# Altium schematic sheet STLink_V2.SchDoc
size A3; DrawnBy: Safak Ozdemir; Revision: V1.0; SheetNumber: 1; SheetTotal: 1
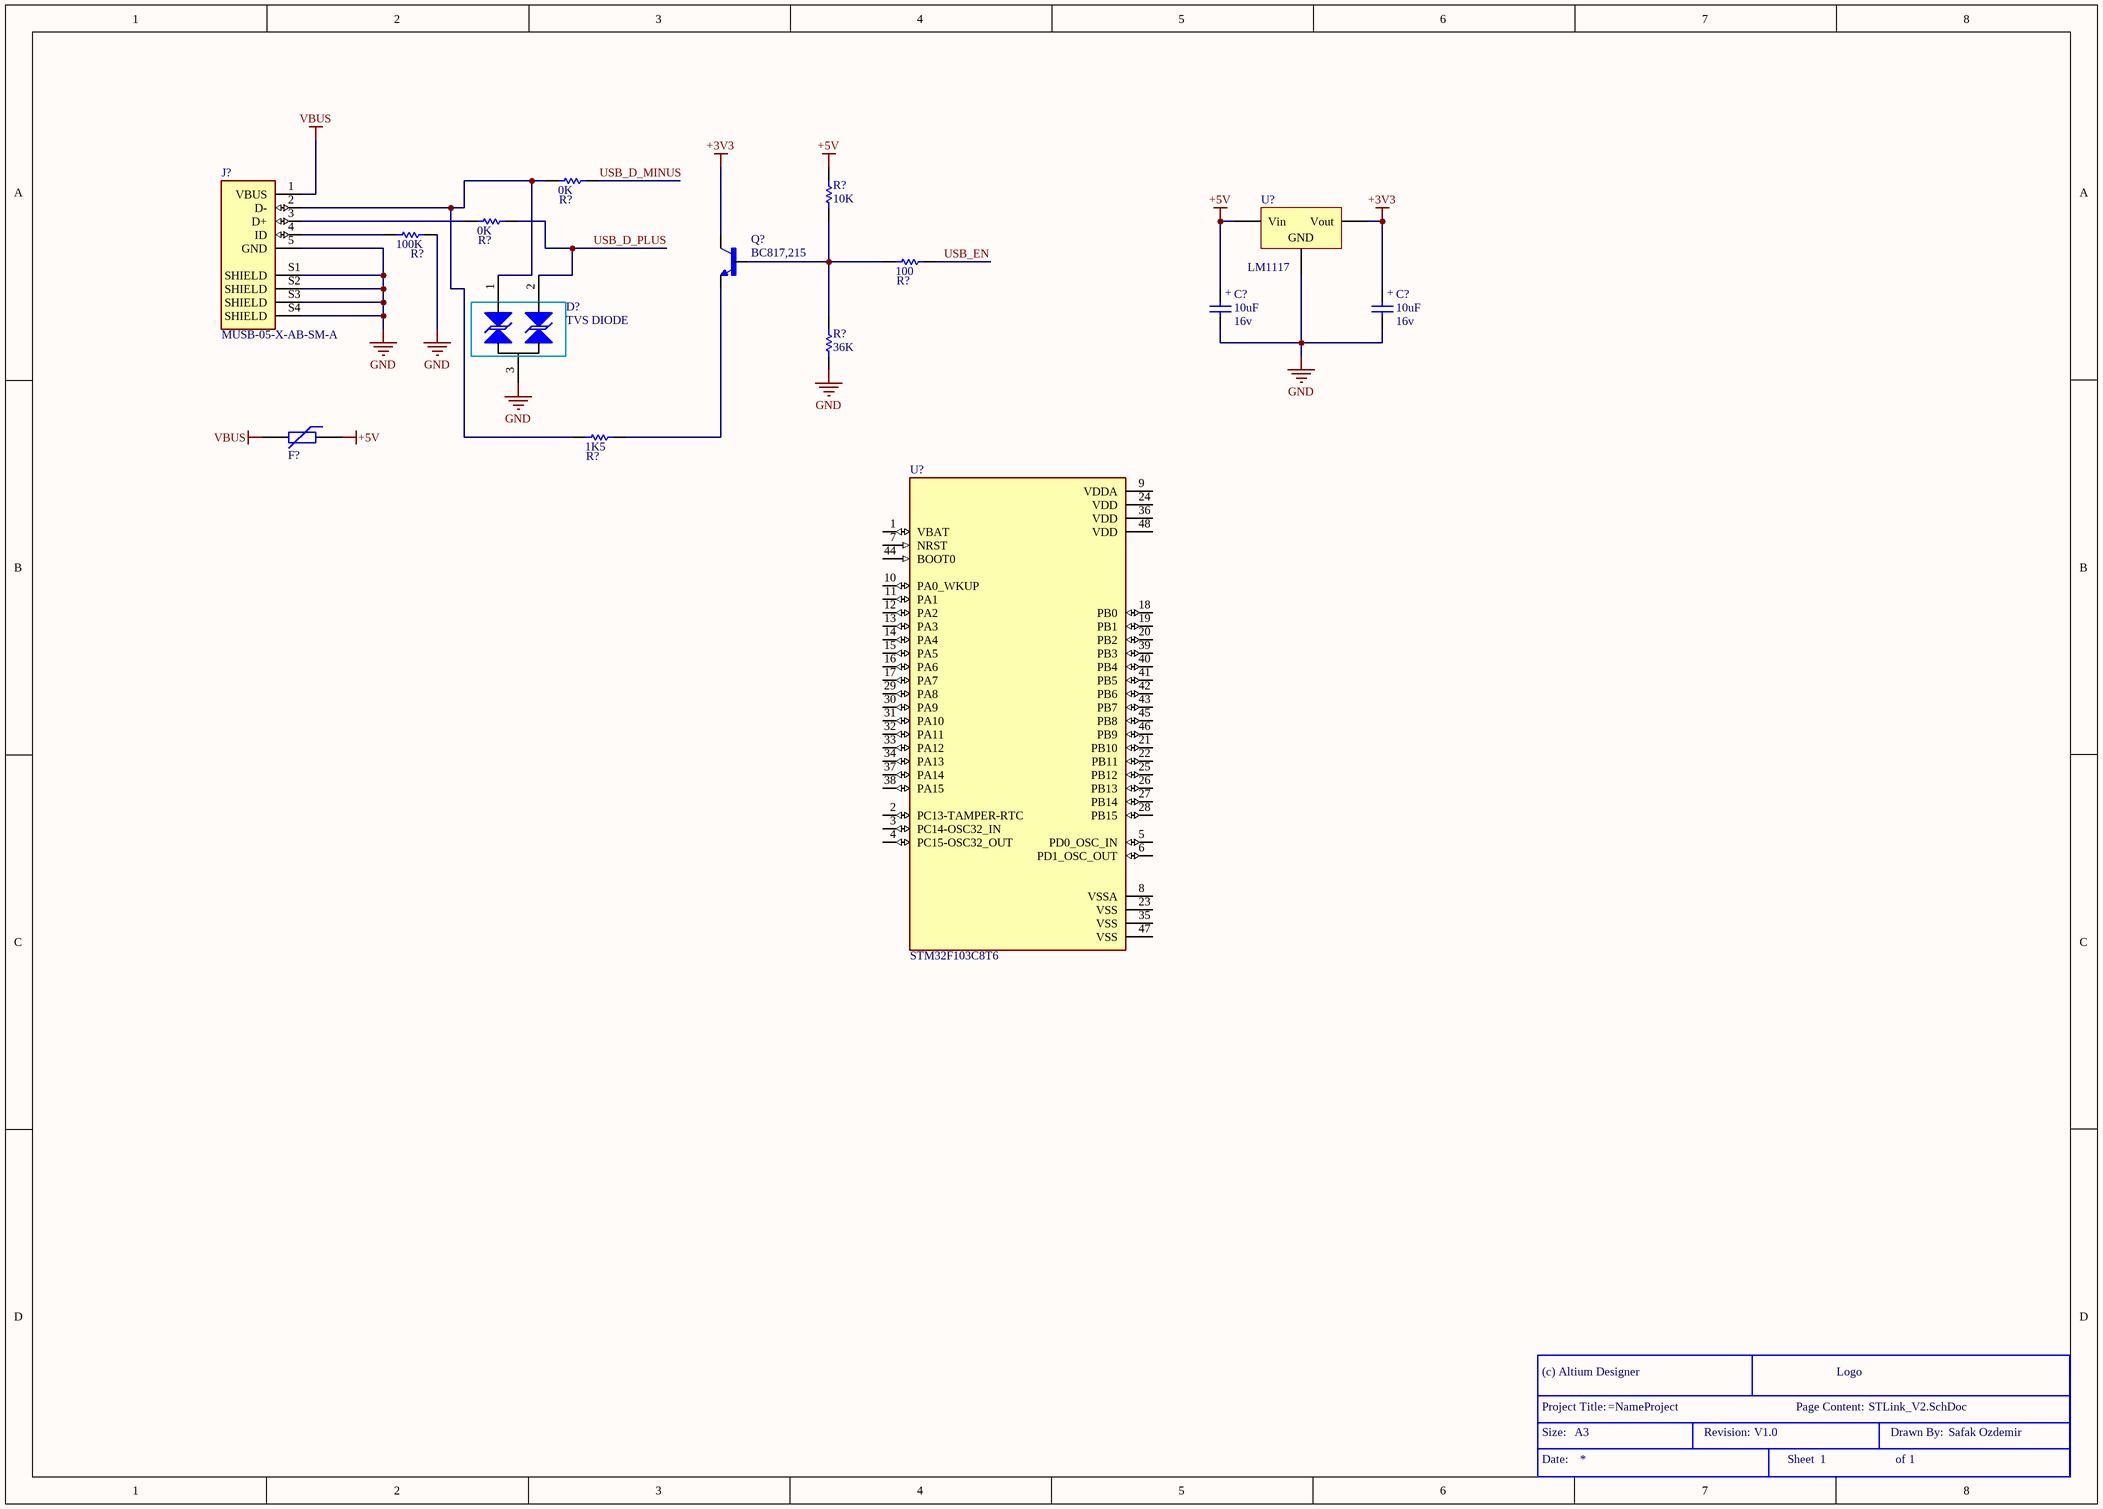
[diagram p0: STLink_V2.SchDoc]

## Parts
(Parts that share a designator on the sheet are numbered #1, #2 ... from top to bottom, then left to right.)
*  Size: A3  Drawn By: Safak Ozdemir  (hidden comment: Title Block)  (graphical)
C?#1  Volte: 16v  [MY_SMC_B]  (hidden comment: 10uF)
C?#2  Volte: 16v  [MY_SMC_B]  (hidden comment: 10uF)
D?  TVS DIODE  [SOT-23]
F?  (no value)  [PTC-0805]
J?  MUSB-05-X-AB-SM-A  [SAMTEC_MUSB-05-X-AB-SM-A]
Q?  BC817,215  [SOT95P230X110-3N]
R?#1  0K  [MY_0805]
R?#2  0K  [MY_0805]
R?#3  10K  [MY_0805]
R?#4  100K  [MY_0805]
R?#5  100  [MY_0805]
R?#6  36K  [MY_0805]
R?#7  1K5  [MY_0805]
U?#1  LM1117  [MY_SOT223]
U?#2  STM32F103C8T6  [QFP50P900X900X160-48N]

## Nets
+3V3: C?#2.+ Q?.3(C) U?#1.2(Vout)
+5V: C?#1.+ F?.1 R?#3.2 U?#1.3(Vin)
GND: C?#1.- C?#2.- D?.3(A) J?.5(GND) J?.S1(SHIELD) J?.S2(SHIELD) J?.S3(SHIELD) J?.S4(SHIELD) R?#4.2 R?#6.2 U?#1.1(GND)
VBUS: F?.2 J?.1(VBUS)
USB_D_MINUS: R?#1.2
USB_D_PLUS: D?.2(K) R?#2.2
USB_EN: R?#5.2
NetD?_1: D?.1(K) J?.2(D-) R?#1.1 R?#7.1
NetJ?_3: J?.3(D+) R?#2.1
NetJ?_4: J?.4(ID) R?#4.1
NetQ?_1: Q?.1(B) R?#3.1 R?#5.1 R?#6.1
NetQ?_2: Q?.2(E) R?#7.2

Not connected (* = marked no-connect by the designer): U?#2 1(VBAT) 2(PC13-TAMPER-RTC) 3(PC14-OSC32_IN) 4(PC15-OSC32_OUT) 5(PD0_OSC_IN) 6(PD1_OSC_OUT) 7(NRST) 8(VSSA) 9(VDDA) 10(PA0_WKUP) 11(PA1) 12(PA2) 13(PA3) 14(PA4) 15(PA5) 16(PA6) 17(PA7) 18(PB0) 19(PB1) 20(PB2) 21(PB10) 22(PB11) 23(VSS) 24(VDD) 25(PB12) 26(PB13) 27(PB14) 28(PB15) 29(PA8) 30(PA9) 31(PA10) 32(PA11) 33(PA12) 34(PA13) 35(VSS) 36(VDD) 37(PA14) 38(PA15) 39(PB3) 40(PB4) 41(PB5) 42(PB6) 43(PB7) 44(BOOT0) 45(PB8) 46(PB9) 47(VSS) 48(VDD)

## Notes on the sheet
- (in symbol Title Block) (c) Altium Designer; Logo; Project Title:; Page Content:; Size:; Revision:; Drawn By:; Date:; Sheet; of

## Library data of the parts
C?#1 C?#2 = Cap Pol: Polar capacitor; ASiD Part Number: C-AS; Value: 10uF
D? = SM712
F? = PTC: Published: 24-Mar-1999; PackageVersion: Mar-2003; PackageReference: 6-0805
J? = MUSB-05-X-AB-SM-A: USB - mini AB Receptacle Connector 5 Position Surface Mount, Right Angle; MF: Samtec; MP: MUSB-05-S-AB-SM-A; Check_prices: https://www.snapeda.com/parts/MUSB-05-S-AB-SM-A/Samtec/view-part/345697/?ref=eda; SnapEDA_Link: https://www.snapeda.com/parts/MUSB-05-S-AB-SM-A/Samtec/view-part/345697/?ref=snap; Price: None; Package: None; Availability: In Stock; Value: *; Purchase-URL: https://pricing.snapeda.com/search/part/MUSB-05-S-AB-SM-A/?ref=eda
Q? = BC817,215: Bipolar (BJT) Transistor NPN 45 V 500 mA 100MHz 250 mW Surface Mount TO-236AB; MF: Nexperia USA Inc.; Price: None; Purchase-URL: https://pricing.snapeda.com/search/part/BC817,215/?ref=eda; MP: BC817,215; Value: *; Availability: In Stock; Package: TO-236-3 Nexperia USA Inc.
R?#1-R?#7 = Res: Standard resistor; ASiD Part Number: Res-AS
  R?#1 R?#2: Value: 0K
  R?#3: Value: 10K
  R?#4: Value: 100K
  R?#5: Value: 100
  R?#6: Value: 36K
  R?#7: Value: 1K5
U?#1 = LM1117: Low Drop Voltage Reg; ASiD Part Number: LM1117-AS
U?#2 = STM32F103C8T6: ARM® Cortex®-M3 STM32F1 Microcontroller IC 32-Bit 72MHz 64KB (64K x 8) FLASH 48-LQFP (7x7); MF: STMicroelectronics; SnapEDA_Link: https://www.snapeda.com/parts/STM32F103C8T6/STMicroelectronics/view-part/?ref=snap; Package: LQFP-48 STMicroelectronics; Value: *; MP: STM32F103C8T6; Check_prices: https://www.snapeda.com/parts/STM32F103C8T6/STMicroelectronics/view-part/?ref=eda